# EAGLE design mcu_energy (EAGLE 9.5.2)
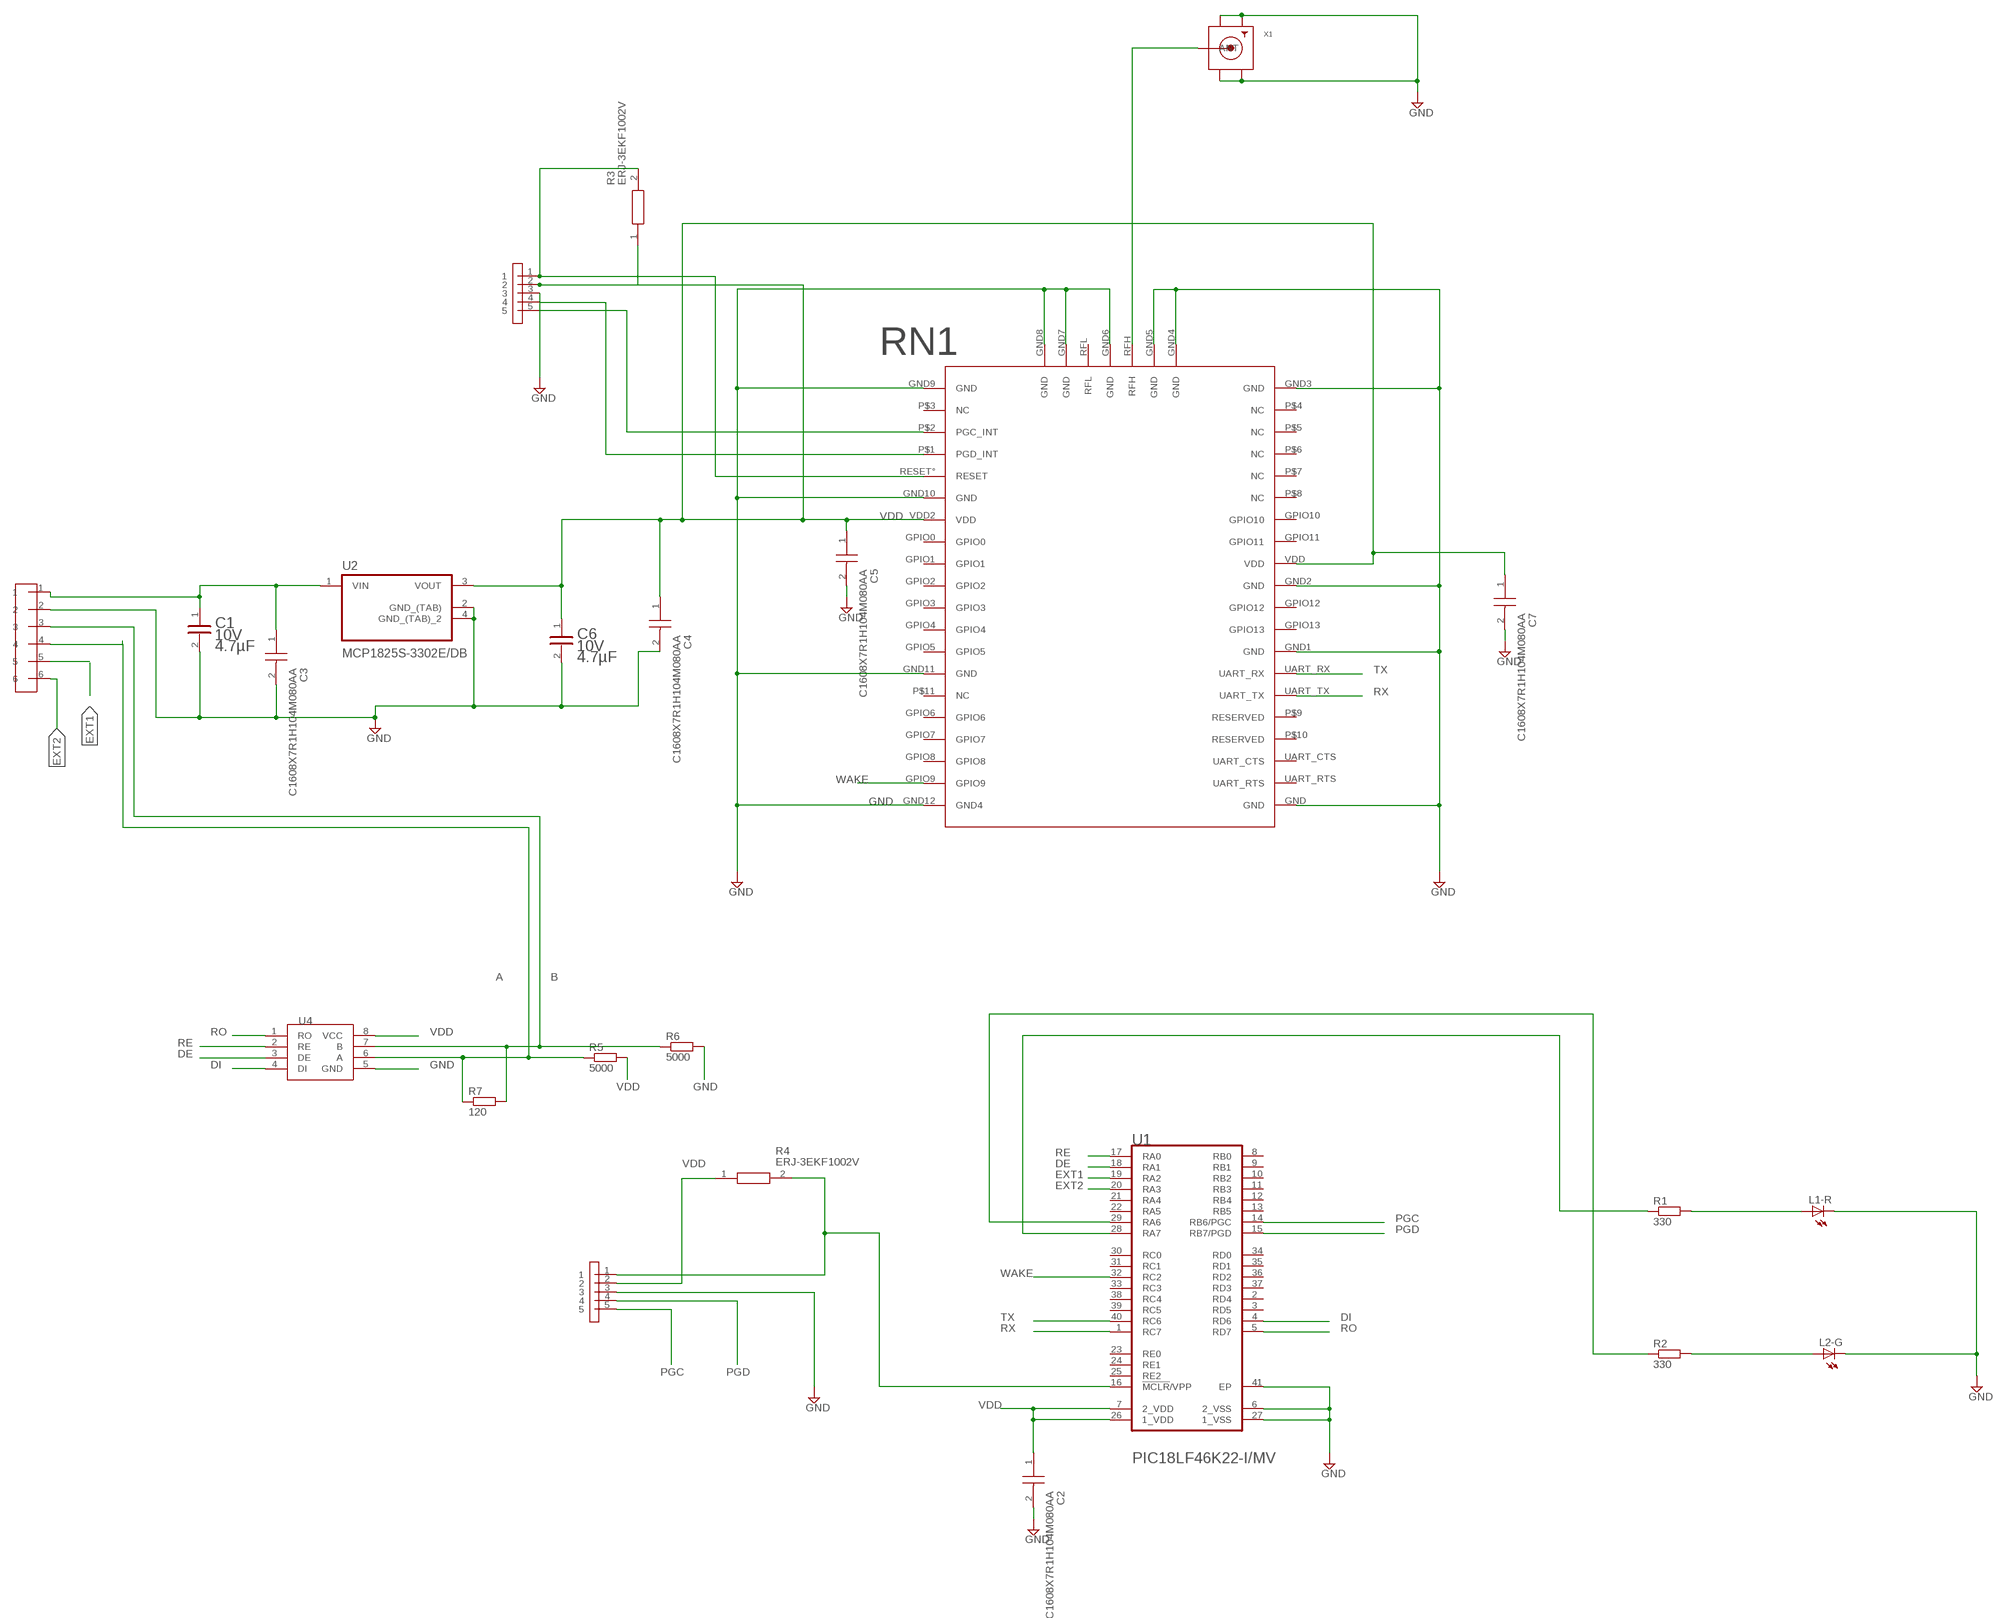
[diagram p0: schematic, sheet 1]

## Parts
C1  KEMET_C0603C475K8PACTUKEMET_C0603C475K8PACTU_0_0  [KEMET_C0603C475K8PACTU_0]
C2  C1608X7R1H104M080AA  [CAPC1608X80N]
C3  C1608X7R1H104M080AA  [CAPC1608X80N]
C4  C1608X7R1H104M080AA  [CAPC1608X80N]
C5  C1608X7R1H104M080AA  [CAPC1608X80N]
C6  KEMET_C0603C475K8PACTUKEMET_C0603C475K8PACTU_0_0  [KEMET_C0603C475K8PACTU_0]
C7  C1608X7R1H104M080AA  [CAPC1608X80N]
L1-R  LEDCHIP-LED0603  [CHIP-LED0603]
L2-G  LEDCHIP-LED0603  [CHIP-LED0603]
R1  330  R-EU_R0603  [R0603]
R2  330  R-EU_R0603  [R0603]
R3  ERJ-3EKF1002V  [RESC1608X55N]
R4  ERJ-3EKF1002V  [RESC1608X55N]
R5  5000  R-EU_R0805  [R0805]
R6  5000  R-EU_R0805  [R0805]
R7  120  R-EU_R0805  [R0805]
RN1  NEW_RN2483  [NEW_RN2483]
U1  MICROCHIP_PIC18LF46K22-I-MVMICROCHIP_PIC18LF46K22-I-MV_0_1  [MICROCHIP_PIC18LF46K22-I-MV_1]
U2  MCP1825S-3302E/DB  [SOT230P700X180-4N]
U4  AMD3485E  [AMD3485E]
U6  CONNECTOR6_V2  [CONNECTOR6_V2]
U$2  ICSP52  [ICSP]
U$3  ICSP_V2  [ICSP_V2]
X1  SMACONNECTOR_EDGE  [SMA_EDGELAUNCH]

## Nets
A: R5.1 R7.1 U4.6(A) U6.4
B: R6.1 R7.2 U4.7(B) U6.3
DE: U1.18(RA1) U4.3(DE)
DI: U1.4(RD6) U4.4(DI)
EXT1: U1.19(RA2) U6.5
EXT2: U1.20(RA3) U6.6
GND: C1.2 C2.2 C3.2 C4.2 C5.2 C6.2 C7.2 L1-R.C L2-G.C R6.2 RN1.GND RN1.GND1(GND) RN1.GND2(GND) RN1.GND3(GND) RN1.GND4(GND) RN1.GND5(GND) RN1.GND6(GND) RN1.GND7(GND) RN1.GND8(GND) RN1.GND9(GND) RN1.GND10(GND) RN1.GND11(GND) RN1.GND12(GND4) U1.6(2_VSS) U1.27(1_VSS) U1.41(EP) U2.2(GND_(TAB)) U2.4(GND_(TAB)_2) U4.5(GND) U6.2 U$2.3 U$3.3 X1.GND@1(GND4) X1.GND@2(GND3) X1.GND@3(GND2) X1.GND@4(GND1)
N$1: L1-R.A R1.2
N$2: L2-G.A R2.2
N$3: R2.1 U1.29(RA6)
N$4: R1.1 U1.28(RA7)
N$5: C1.1 C3.1 U2.1(VIN) U6.1
N$6: RN1.P$2(PGC_INT) U$3.5
N$7: R4.2 U1.16(!MCLR!/VPP) U$2.1
N$8: RN1.P$1(PGD_INT) U$3.4
N$9: R3.2 RN1.RESET°(RESET) U$3.1
N$10: RN1.RFH X1.P(ANT)
PGC: U1.14(RB6/PGC) U$2.5
PGD: U1.15(RB7/PGD) U$2.4
RE: U1.17(RA0) U4.2(RE)
RO: U1.5(RD7) U4.1(RO)
RX: RN1.UART_TX U1.1(RC7)
TX: RN1.UART_RX U1.40(RC6)
VDD: C2.1 C4.1 C5.1 C6.1 C7.1 R3.1 R4.1 R5.2 RN1.VDD RN1.VDD2(VDD) U1.7(2_VDD) U1.26(1_VDD) U2.3(VOUT) U4.8(VCC) U$2.2 U$3.2
WAKE: RN1.GPIO9 U1.32(RC2)
Unconnected: RN1.GPIO0 RN1.GPIO1 RN1.GPIO2 RN1.GPIO3 RN1.GPIO4 RN1.GPIO5 RN1.GPIO6 RN1.GPIO7 RN1.GPIO8 RN1.GPIO10 RN1.GPIO11 RN1.GPIO12 RN1.GPIO13 RN1.P$3(NC) RN1.P$4(NC) RN1.P$5(NC) RN1.P$6(NC) RN1.P$7(NC) RN1.P$8(NC) RN1.P$9(RESERVED) RN1.P$10(RESERVED) RN1.P$11(NC) RN1.RFL RN1.UART_CTS RN1.UART_RTS U1.2(RD4) U1.3(RD5) U1.8(RB0) U1.9(RB1) U1.10(RB2) U1.11(RB3) U1.12(RB4) U1.13(RB5) U1.21(RA4) U1.22(RA5) U1.23(RE0) U1.24(RE1) U1.25(RE2) U1.30(RC0) U1.31(RC1) U1.33(RC3) U1.34(RD0) U1.35(RD1) U1.36(RD2) U1.37(RD3) U1.38(RC4) U1.39(RC5)

## Library data of the parts
C1 C6 = Kemet - C0603C475K8PACTU:KEMET_C0603C475K8PACTU: CAP CER 4.7UF 10V X5R 0603; CAPACITANCE: 4.7µF; CENTROID_NOT_SPECIFIED: No; DATASHEET: https://search.kemet.com/component-edge/download/datasheet/C0603C475K8PACTU.pdf; DIGIKEY_DESCRIPTION: CAP CER 4.7UF 10V X5R 0603; DIGIKEY_PART_NUMBER: 399-5503-1-ND; LEAD_FREE: yes; MF: Kemet; MFG_PACKAGE_IDENT: C0603; MOUSER_DESCRIPTION: Multilayer Ceramic Capacitors MLCC - SMD/SMT 10volts 4.7uF 10% X5R; MOUSER_PART_NUMBER: 80-C0603C475K8P; MPN: C0603C475K8PACTU; PACKAGE: 0603; PREFIX: C; ROHS: yes; TEMPERATURE_RANGE_HIGH: +85°C; TEMPERATURE_RANGE_LOW: -55°C; VOLTAGE: 10V
C2-C5 C7 = C1608X7R1H104M080AA:C1608X7R1H104M080AA: TDK 0603 C 100nF Ceramic Multilayer Capacitor, 50 V dc, +125C, X7R Dielectric, +/-20% Source: Datasheet <https://product.tdk.com/info/en/catalog/datasheets/mlcc_commercial_midvoltage_en.pdf>; ARROW_PART_NUMBER: C1608X7R1H104M080AA; ARROW_PRICE-STOCK: https://www.arrow.com/en/products/c1608x7r1h104m080aa/tdk; DESCRIPTION: TDK 0603 C 100nF Ceramic Multilayer Capacitor, 50 V dc, +125C, X7R Dielectric, +/-20%; HEIGHT: 0.8mm; MANUFACTURER_NAME: TDK; MANUFACTURER_PART_NUMBER: C1608X7R1H104M080AA; MOUSER_PART_NUMBER: 810-C1608X7R1H104M; MOUSER_PRICE-STOCK: https://www.mouser.co.uk/ProductDetail/TDK/C1608X7R1H104M080AA?qs=dfay7wIA1uEL2BE%2FFUaTdg%3D%3D
L1-R L2-G = adafruit:LED: LED OSRAM: - CHIPLED LG R971, LG N971, LY N971, LG Q971, LY Q971, LO R971, LY R971 LH N974, LH R974 LS Q976, LO Q976, LY Q976 LO Q996 - Hyper CHIPLED LW Q18S LB Q993, LB Q99A, LB R99A - SideLED LS A670, LO A670, LY A670, LG A670, LP A670 LB A673, LV A673, LT A673, LW A673 LH A674 LY A675 LS A676, LA A676, LO A676, LY A676, LW A676 LS A679, LY A679, LG A679 - Hyper Micro SIDELED® LS Y876, LA Y876, LO Y876, LY Y876 LT Y87S - SmartLED LW L88C, LW L88S LB L89C, LB L89S, LG L890 LS L89K, LO L89K, LY L89K LS L896, LA L896, LO L896, LY L896 - TOPLED LS T670, LO T670, LY T670, LG T670, LP T670 LSG T670, LSP T670, LSY T670, LOP T670, LYG T670 LG T671, LOG T671, LSG T671 LB T673, LV T673, LT T673, LW T673 LH T674 LS T676, LA T676, LO T676, LY T676, LB T676, LH T676, LSB T676, LW T676 LB T67C, LV T67C, LT T67C, LS T67K, LO T67K, LY T67K, LW E67C LS E67B, LA E67B, LO E67B, LY E67B, LB E67C, LV E67C, LT E67C LW T67C LS T679, LY T679, LG T679 LS T770, LO T770, LY T770, LG T770, LP T770 LB T773, LV T773, LT T773, LW T773 LH T774 LS E675, LA E675, LY E675, LS T675 LS T776, LA T776, LO T776, LY T776, LB T776 LHGB T686 LT T68C, LB T68C - Hyper Mini TOPLED® LB M676 - Mini TOPLED Santana® LG M470 LS M47K, LO M47K, LY M47K Source: http://www.osram.convergy.de/
R1 R2 = rcl:R-EU_: RESISTOR, European symbol
R3 R4 = ERJ-3EKF1002V:ERJ-3EKF1002V: Thick Film Resistors - SMD 0603 10Kohms 1% AEC-Q200 Source: Datasheet <http://industrial.panasonic.com/cdbs/www-data/pdf/RDA0000/AOA0000C86.pdf>; ARROW_PART_NUMBER: ERJ-3EKF1002V; ARROW_PRICE-STOCK: https://www.arrow.com/en/products/erj-3ekf1002v/panasonic; DESCRIPTION: Thick Film Resistors - SMD 0603 10Kohms 1% AEC-Q200; HEIGHT: 0.55mm; MANUFACTURER_NAME: Panasonic; MANUFACTURER_PART_NUMBER: ERJ-3EKF1002V; MOUSER_PART_NUMBER: 667-ERJ-3EKF1002V; MOUSER_PRICE-STOCK: https://www.mouser.co.uk/ProductDetail/Panasonic/ERJ-3EKF1002V?qs=H7k1u0Mp9JSrGPQ5%2F5COuw%3D%3D
R5-R7 = rcl:R-EU_: RESISTOR, European symbol; SPICEPREFIX: R
RN1 = tobias:NEW_RN2483
U1 = MV:MICROCHIP_PIC18LF46K22-I-MV: MCHP-PIC18F4XK22-UQFN-40; CIIVA_IDS: 1156885; COMPONENT_LINK_2_DESCRIPTION: Package Specification; COMPONENT_LINK_2_URL: http://www.microchip.com/stellent/groups/techpub_sg/documents/packagingspec/en012702.pdf; COMPONENT_LINK_3_DESCRIPTION: URL Link1; COMPONENT_LINK_3_URL: Product URL:http://www.microchip.com/datasheet/PIC18F46K22; DATASHEET: http://ww1.microchip.com/downloads/en/DeviceDoc/41412F.pdf; DATASHEET_VERSION: Rev. F; DIGITAL_COMMUNICATION: 2-A/E/USART, 2-MSSP(SPI/I2C); EEPROM_DATA_MEMORY_BYTES: 1024; FOOTPRINT_VARIANT_NAME_0: Level C; FOOTPRINT_VARIANT_NAME_1: Level B; FOOTPRINT_VARIANT_NAME_2: Level A; IMPORTED: yes; IMPORTED_FROM: vault; IMPORT_TS: 1521862508; INTERNAL_OSCILLATOR: 16 MHz, 31 kHz; IO_PINS: 35; MAX_CPU_SPEED_MHZ: 16; MEMORY_TYPE: Flash; MF: Microchip; MOUNTING_TECHNOLOGY: Surface Mount; MPN: PIC18LF46K22-I/MV; OF_AD_CHANNELS: 28; OPERATION_VOLTAGE_RANGE: 1.8V - 3.6V; PACKAGE: UQFN-MV40; PACKAGE_DESCRIPTION: 40-Lead Plastic Ultra Thin Quad Flat, No Lead Package, Body 5 x 5 mm, Pitch 0.4 mm; PACKAGE_VERSION: C04-156A, 04/2013; PACKING: TUBE; PIN_0_0_13_INSIDE_EDGE: clock; PREFIX: U; PROGRAM_MEMORY_KBYTES: 64; PROGRAM_MEMORY_KWORDS: 32; RAM: 3896; RELEASE_DATE: 1370054166; TIMERS: 3 - 8-bit, 4 - 16-bit; VAULT_GUID: 4AD4499F-4258-456F-8BC1-D82EC74C6FCE; VAULT_REVISION: 1F45D5E2-C531-4F36-B47A-F05F4A728A22
U2 = MCP1825S-3302E_DB:MCP1825S-3302E/DB; AVAILABILITY: Unavailable; DESCRIPTION: Linear Voltage Regulator IC 1 Output 500mA SOT-223-3; MF: Microchip; MP: MCP1825S-3302E/DB; PACKAGE: SOT-223 Microchip; PRICE: None
U4 = AMD3485E:AMD3485E
U6 = conn4:CONNECTOR6_V2
U$2 = conn4:ICSP52
U$3 = conn4:ICSP_V2
X1 = adafruit:SMACONNECTOR: SMA Connector 90° DIP SMA Connector, 50 Ohm (4UConnector: 07259)

## Net classes
0 default: clearance 0.254 mm

## Board
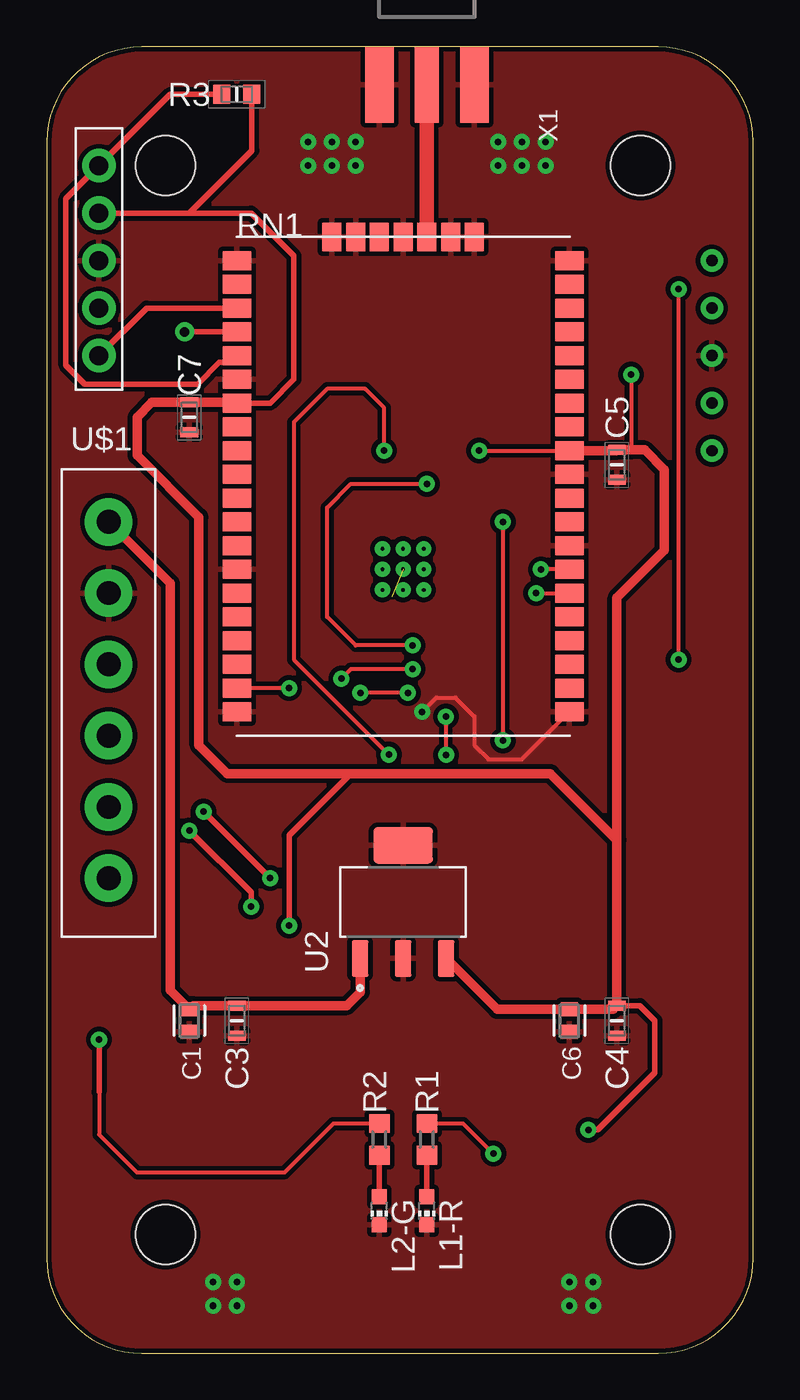
[diagram p1: board, top side]
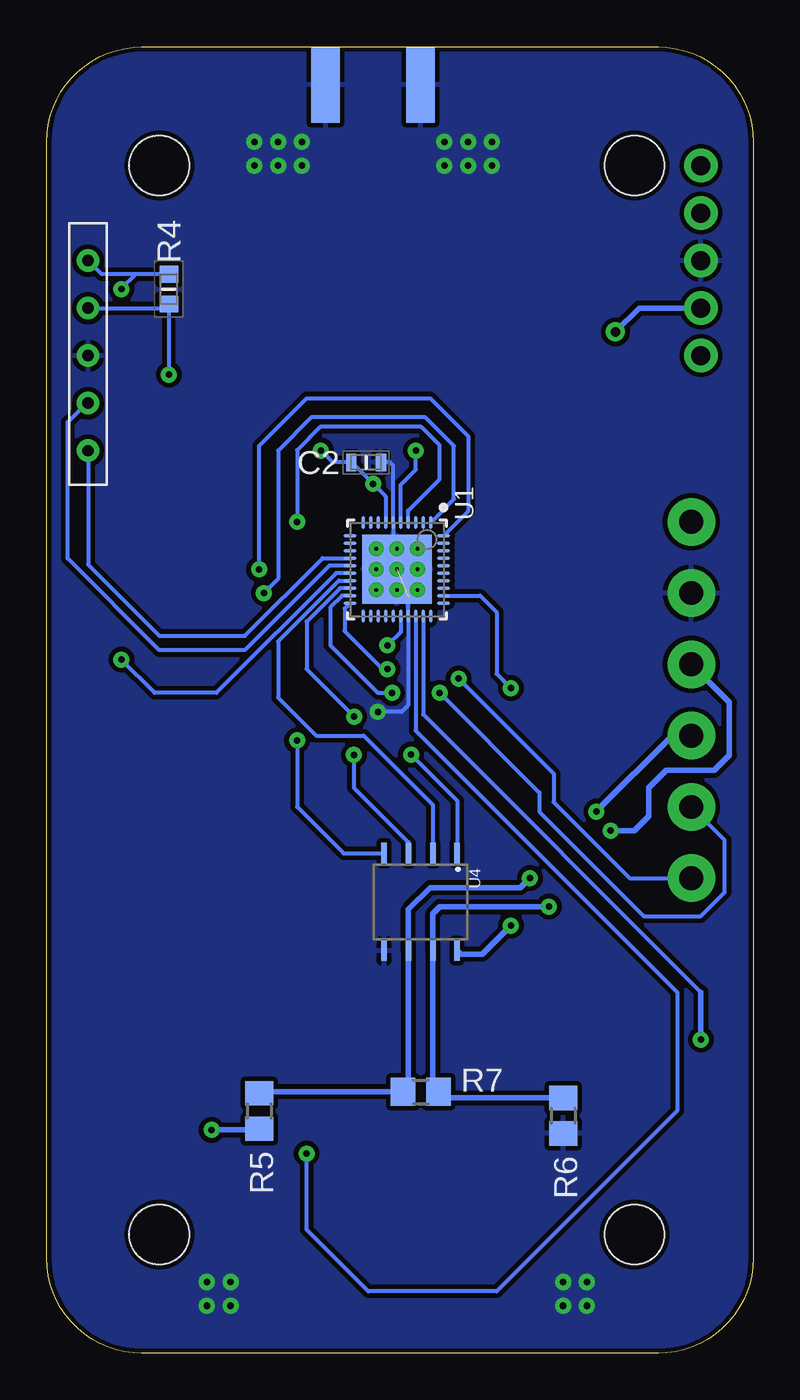
[diagram p2: board, bottom side, seen from below]

Size 37.77 x 69.84 mm. Coordinates in mm from the lower left corner, seen from the top.
Outline: 0,64.76 0,5.08 arc90 5.08,0 32.69,0 arc90 37.77,5.08 37.77,64.76 arc90 32.69,69.84 5.08,69.84 arc90 0,64.76
Copper layers (1*16): Top 0.035mm / dielectric 1.5mm / Bottom 0.035mm
Design rules "SparkFun": minimum track width 8mil, minimum drill 20mil, track to track 8mil, track to pad 8mil, pad to pad 8mil, via to via 8mil, smd to smd 8mil, copper to edge 10mil, drill to drill 8mil, minimum pad ring 12mil, minimum via ring 10mil, stop-mask expansion 4mil, vias tented up to drill 25mil, thermal gap 10mil
Holes 3.2 mm at 31.75,63.5 31.75,6.35 6.35,6.35 6.35,63.5

### Footprints (pad centres in the part's own frame; a part is rotated, then mirrored left to right if it is on the bottom)
KEMET_C0603C475K8PACTU_0 = smd 0.75 x 0.9: 1 -0.6,0; 2 0.6,0
CAPC1608X80N = smd 0.54 x 0.94: 1 -0.8,0; 2 0.8,0
CHIP-LED0603 = smd 0.8 x 0.8: A 0,-0.75; C 0,0.75
R0603 = smd 1 x 1.1: 1 -0.85,0; 2 0.85,0
RESC1608X55N = smd 0.9 x 1: 1 -0.8,0; 2 0.8,0
R0805 = smd 1.3 x 1.5: 1 -0.95,0; 2 0.95,0
NEW_RN2483 = smd 1.524 x 1.016: GND 17.78,1.27; GND1 17.78,10.16; GND2 17.78,13.97; GND3 17.78,25.4; GND9 0,25.4; GND10 0,19.05; GND11 0,8.89; GND12 0,1.27; GPIO0 0,16.51; GPIO1 0,15.24; GPIO2 0,13.97; GPIO3 0,12.7; GPIO4 0,11.43; GPIO5 0,10.16; GPIO6 0,6.35; GPIO7 0,5.08; GPIO8 0,3.81; GPIO9 0,2.54; GPIO10 17.78,17.78; GPIO11 17.78,16.51; GPIO12 17.78,12.7; GPIO13 17.78,11.43; P$1 0,21.59; P$2 0,22.86; P$3 0,24.13; P$4 17.78,24.13; P$5 17.78,22.86; P$6 17.78,21.59; P$7 17.78,20.32; P$8 17.78,19.05; P$9 17.78,6.35; P$10 17.78,5.08; P$11 0,7.62; RESET° 0,20.32; UART_CTS 17.78,3.81; UART_RTS 17.78,2.54; UART_RX 17.78,8.89; UART_TX 17.78,7.62; VDD 17.78,15.24; VDD2 0,17.78 | smd 1.016 x 1.524: GND4 12.7,26.67; GND5 11.43,26.67; GND6 8.89,26.67; GND7 6.35,26.67; GND8 5.08,26.67; RFH 10.16,26.67; RFL 7.62,26.67
MICROCHIP_PIC18LF46K22-I-MV_1 = smd 0.7 x 0.2: 1 -2.5,1.8; 2 -2.5,1.4; 3 -2.5,1; 4 -2.5,0.6; 5 -2.5,0.2; 6 -2.5,-0.2; 7 -2.5,-0.6; 8 -2.5,-1; 9 -2.5,-1.4; 10 -2.5,-1.8; 21 2.5,-1.8; 22 2.5,-1.4; 23 2.5,-1; 24 2.5,-0.6; 25 2.5,-0.2; 26 2.5,0.2; 27 2.5,0.6; 28 2.5,1; 29 2.5,1.4; 30 2.5,1.8 | smd 0.2 x 0.7: 11 -1.8,-2.5; 12 -1.4,-2.5; 13 -1,-2.5; 14 -0.6,-2.5; 15 -0.2,-2.5; 16 0.2,-2.5; 17 0.6,-2.5; 18 1,-2.5; 19 1.4,-2.5; 20 1.8,-2.5; 31 1.8,2.5; 32 1.4,2.5; 33 1,2.5; 34 0.6,2.5; 35 0.2,2.5; 36 -0.2,2.5; 37 -0.6,2.5; 38 -1,2.5; 39 -1.4,2.5; 40 -1.8,2.5 | smd 3.7 x 3.7: 41 0,0 | drill 0.2 pad 0.5: PAD_1 1.1,-1.1; PAD_2 0,-1.1; PAD_3 -1.1,-1.1; PAD_4 1.1,0; PAD_5 0,0; PAD_6 -1.1,0; PAD_7 1.1,1.1; PAD_8 0,1.1; PAD_9 -1.1,1.1
SOT230P700X180-4N = smd 1.97 x 0.89: 1 -3.025,2.3; 2 -3.025,0; 3 -3.025,-2.3 | smd 1.97 x 3.19: 4 3.025,0
AMD3485E = smd 1.1 x 0.3: 1 -2.6,1.95; 2 -2.6,0.65; 3 -2.6,-0.65; 4 -2.6,-1.95; 5 2.6,-1.95; 6 2.6,-0.65; 7 2.6,0.65; 8 2.6,1.95
CONNECTOR6_V2 = drill 1.27 pad 2.54: 1 -0.5,-3.81; 2 -0.5,-7.62; 3 -0.5,-11.43; 4 -0.5,-15.24; 5 -0.5,-19.05; 6 -0.5,-22.86
ICSP = drill 0.6: 1 -0.002,-0.002; 2 -0.002,-2.542; 3 -0.002,-5.082; 4 -0.002,-7.622; 5 -0.002,-10.162
ICSP_V2 = drill 1.016 pad 1.778: 1 -0.002,-0.002; 2 -0.002,-2.542; 3 -0.002,-5.082; 4 -0.002,-7.622; 5 -0.002,-10.162
SMA_EDGELAUNCH = smd 4.064 x 1.524: GND@1 2.032,-2.54; GND@2 2.032,2.54 | smd 4.064 x 1.524 bottom: GND@3 2.032,2.54; GND@4 2.032,-2.54 | smd 4.064 x 1.27: P 2.032,0

### Placement (x,y rotation side)
C1  7.62,17.78 270 top
C2  20.7,47.62 0 bottom
C3  10.16,17.78 270 top
C4  30.48,17.78 270 top
C5  30.48,47.5 270 top
C6  27.94,17.78 270 top
C7  7.62,50.04 270 top
L1-R  20.32,7.62 180 top
L2-G  17.78,7.62 180 top
R1  20.32,11.43 270 top
R2  17.78,11.43 270 top
R3  10.16,67.31 180 top
R4  31.24,56.9 90 bottom
R5  26.42,12.95 270 bottom
R6  10.16,12.7 270 bottom
R7  17.78,13.97 0 bottom
RN1  10.16,33.02 0 top
U1  19.05,41.91 270 bottom
U2  19.05,24.13 90 top
U4  17.78,24.13 270 bottom
U6  3.81,48.26 0 top
U$2  35.56,58.42 0 bottom
U$3  2.79,63.5 0 top
X1  20.32,69.85 270 top

### Tracks (layer width: path | path; a pad name or v marks a point on that pad's centre or on a via)
A  (via drill 0.35)
  Top 0.305: v8.38,28.96 v11.94,25.4
  Bottom 0.305: R5.1 26.35,13.97 R7.1 18.43,14.27 U4.6 18.43,23.73 17.27,24.89 12.45,24.89 v11.94,25.4 | v8.38,28.96 4.33,33.02 U6.4
B  (via drill 0.35)
  Top 0.305: v10.92,23.88 10.92,24.64 v7.62,27.94
  Bottom 0.305: R6.1 16.51,13.65 R7.2 17.13,14.27 U4.7 17.13,23.51 16.76,23.88 v10.92,23.88 | v7.62,27.94 6.35,27.94 5.59,28.7 5.59,30.23 4.65,31.17 2.08,31.17 1.27,31.98 1.27,34.8 U6.3
DE  (via drill 0.35)
  Top 0.203: v21.34,34.04 21.34,32 v21.35,31.99
  Bottom 0.203: U1.18 22.08,40.91 23.88,39.12 23.88,36.58 v21.34,34.04 | v21.35,31.99 21.35,30.24 18.43,27.32 U4.3
DI  (via drill 0.35)
  Top 0.203: v24.38,44.45 v24.38,32.77
  Bottom 0.203: U1.4 18.45,45.05 16.76,46.74 16.76,48.54 17.76,49.53 23.14,49.53 24.38,48.28 v24.38,44.45 | v24.38,32.77 24.38,29.21 21.9,26.73 U4.4
EXT1  (via drill 0.35)
  Top 0.203: v19.3,35.31 v16.76,35.31
  Bottom 0.203: U1.19 21.97,40.51 22.61,39.88 22.61,37.85 20.07,35.31 v19.3,35.31 | v16.76,35.31 11.43,29.97 11.43,28.96 5.84,23.37 2.79,23.37 1.52,24.64 1.52,27.42 U6.5
EXT2  (via drill 0.35)
  Top 0.203: v19.56,36.58 16.26,36.58 v15.75,36.07
  Bottom 0.203: U1.20 21.84,39.82 21.84,38.61 19.81,36.58 v19.56,36.58 | v15.75,36.07 10.67,30.99 10.67,29.46 6.6,25.4 U6.6
GND  (via drill 0.35)  (1 unrouted)
  Top 0.203: v20.07,34.29 20.83,35.05 21.84,35.05 22.86,34.04 22.86,32.51 23.62,31.75 25.4,31.75 RN1.GND
  Bottom 0.203: 18.45,40.45 U1.27 18.45,34.64 18.8,34.29 v20.07,34.29 | C2.2 19.43,47.62 19.25,47.44 U1.6 19.25,43.13 19.05,42.93 19.05,42.16 U1.41
  other vias: 16.51,64.77 16.51,63.5 15.24,63.5 15.24,64.77 13.97,64.77 13.97,63.5 24.13,64.77 24.13,63.5 25.4,64.77 25.4,63.5 26.67,63.5 26.67,64.77 8.89,3.81 10.16,3.81 10.16,2.54 8.89,2.54 29.21,3.81 29.21,2.54 27.94,3.81 27.94,2.54
  pour Bottom: -2.54,72.39 40.64,72.39 40.64,-2.54 -2.54,-2.54
  pour Top: -2.54,71.88 41.91,71.88 41.91,-1.27 39.88,-3.3 -1.78,-3.3 -3.3,-1.78 -3.3,71.12
N$1
  Top 0.305: R1.2 L1-R.A
N$2
  Top 0.305: R2.2 L2-G.A
N$3  (via drill 0.35)
  Top 0.203: R2.1 15.33,12.28 12.7,9.65 4.83,9.65 2.79,11.68 2.79,13.97
  Top 0.305: v2.79,16.76 2.79,13.97
  Bottom 0.203: U1.29 17.65,34.16 2.79,19.3
  Bottom 0.305: 2.79,19.3 v2.79,16.76
N$4  (via drill 0.35)
  Top 0.203: v23.88,10.67 22.26,12.28 R1.1
  Bottom 0.203: U1.28 18.05,33.29 4.06,19.3 4.06,12.95 13.72,3.3 20.57,3.3 23.88,6.6 v23.88,10.67
N$5
  Top 0.508: U6.1 6.6,41.16 6.6,27.94 6.6,19.4 C1.1 7.82,18.58 C3.1 16.04,18.58 16.76,19.3 16.76,21.09 U2.1
N$6
  Top 0.305: U$3.5 5.33,55.88 RN1.P$2
N$7  (via drill 0.35)
  Top 0.203: v33.78,37.08 v33.78,56.9
  Bottom 0.203: R4.2 33.02,57.7 | 33.02,57.7 34.84,57.7 U$2.1 | U1.16 22.3,41.71 28.7,35.31 32,35.31 v33.78,37.08 | v33.78,56.9 33.78,56.93 33.02,57.7
N$8  (via drill 0.51)
  Top 0.305: v7.37,54.61 RN1.P$1
  Bottom 0.305: U$3.4 6.1,55.88 v7.37,54.61
N$9
  Top 0.305: R3.2 6.6,67.31 U$3.1 1.02,61.72 1.02,52.83 2.03,51.82 8.06,51.82 9.23,52.98 9.8,52.98 RN1.RESET°
N$10
  Top 0.762: RN1.RFH X1.P
PGC
  Bottom 0.203: U$2.5 35.56,42.17 31.75,38.35 27.18,38.35 23.02,42.51 U1.14
PGD
  Bottom 0.203: U1.15 22.66,42.11 27.18,37.59 31.75,37.59 36.65,42.49 36.65,49.78 35.64,50.8 U$2.4
RE
  Bottom 0.203: U4.2 17.13,29.32 20.83,33.02 23.37,33.02 25.4,35.05 25.4,38.06 22.16,41.31 U1.17
RO  (via drill 0.35)
  Top 0.203: v18.03,48.26 18.03,50.55 17.02,51.56 14.99,51.56 13.21,49.78 13.21,37.08 v18.29,32
  Bottom 0.203: v18.29,32 15.83,29.55 U4.1 | v18.03,48.26 18.03,47.24 18.85,46.43 U1.5
RX  (via drill 0.35)
  Top 0.203: v26.16,40.64 RN1.UART_TX
  Bottom 0.203: U1.1 16,45.66 16,48.51 17.53,50.04 23.62,50.04 25.4,48.26 25.4,41.4 v26.16,40.64
TX  (via drill 0.35)
  Top 0.203: RN1.UART_RX v26.42,41.91
  Bottom 0.203: U1.40 15.24,45.02 15.24,49.02 17.27,51.05 23.88,51.05 26.42,48.51 v26.42,41.91
VDD  (via drill 0.35)
  Top 0.203: v19.56,37.85 16.51,37.85 14.99,39.37 14.99,45.21 16.26,46.48 v20.32,46.48 | v23.11,48.26 RN1.VDD | v31.24,52.32 31.24,48.3
  Top 0.305: C4.1 31.71,18.58 32.51,17.78 32.51,14.99 29.46,11.94 v28.96,11.94 | 16.26,30.99 12.95,27.69 v12.95,22.86 | R3.1 10.96,64.3 7.62,60.96 | U$3.2 7.62,60.96 | 7.62,60.96 10.92,60.96 13.21,58.67 13.21,52.07 11.94,50.8 RN1.VDD2
  Top 0.508: U2.3 24.07,18.38 C6.1 30.28,18.38 C4.1 30.48,27.43 | 30.48,27.43 30.48,40.39 33.02,42.93 33.02,47.24 31.97,48.3 31.24,48.3 C5.1 30.44,48.26 RN1.VDD | 30.48,27.43 26.92,30.99 16.26,30.99 9.65,30.99 8.13,32.51 8.13,44.7 4.83,48.01 4.83,50.04 5.63,50.84 C7.1 10.12,50.84 RN1.VDD2
  Bottom 0.203: U1.7 19.65,45.81 v20.32,46.48 21.46,47.62 C2.1 22.48,47.62 v23.11,48.26 | U1.26 18.85,38.55 v19.56,37.85 | U$2.2 31.46,55.88 R4.1 v31.24,52.32
  Bottom 0.305: v28.96,11.94 26.48,11.94 R5.2 | v12.95,22.86 14.48,21.34 15.64,21.34 U4.8
WAKE  (via drill 0.35)
  Top 0.203: v12.95,35.56 RN1.GPIO9
  Bottom 0.203: U1.32 14.6,40.51 13.72,39.62 13.72,36.32 v12.95,35.56